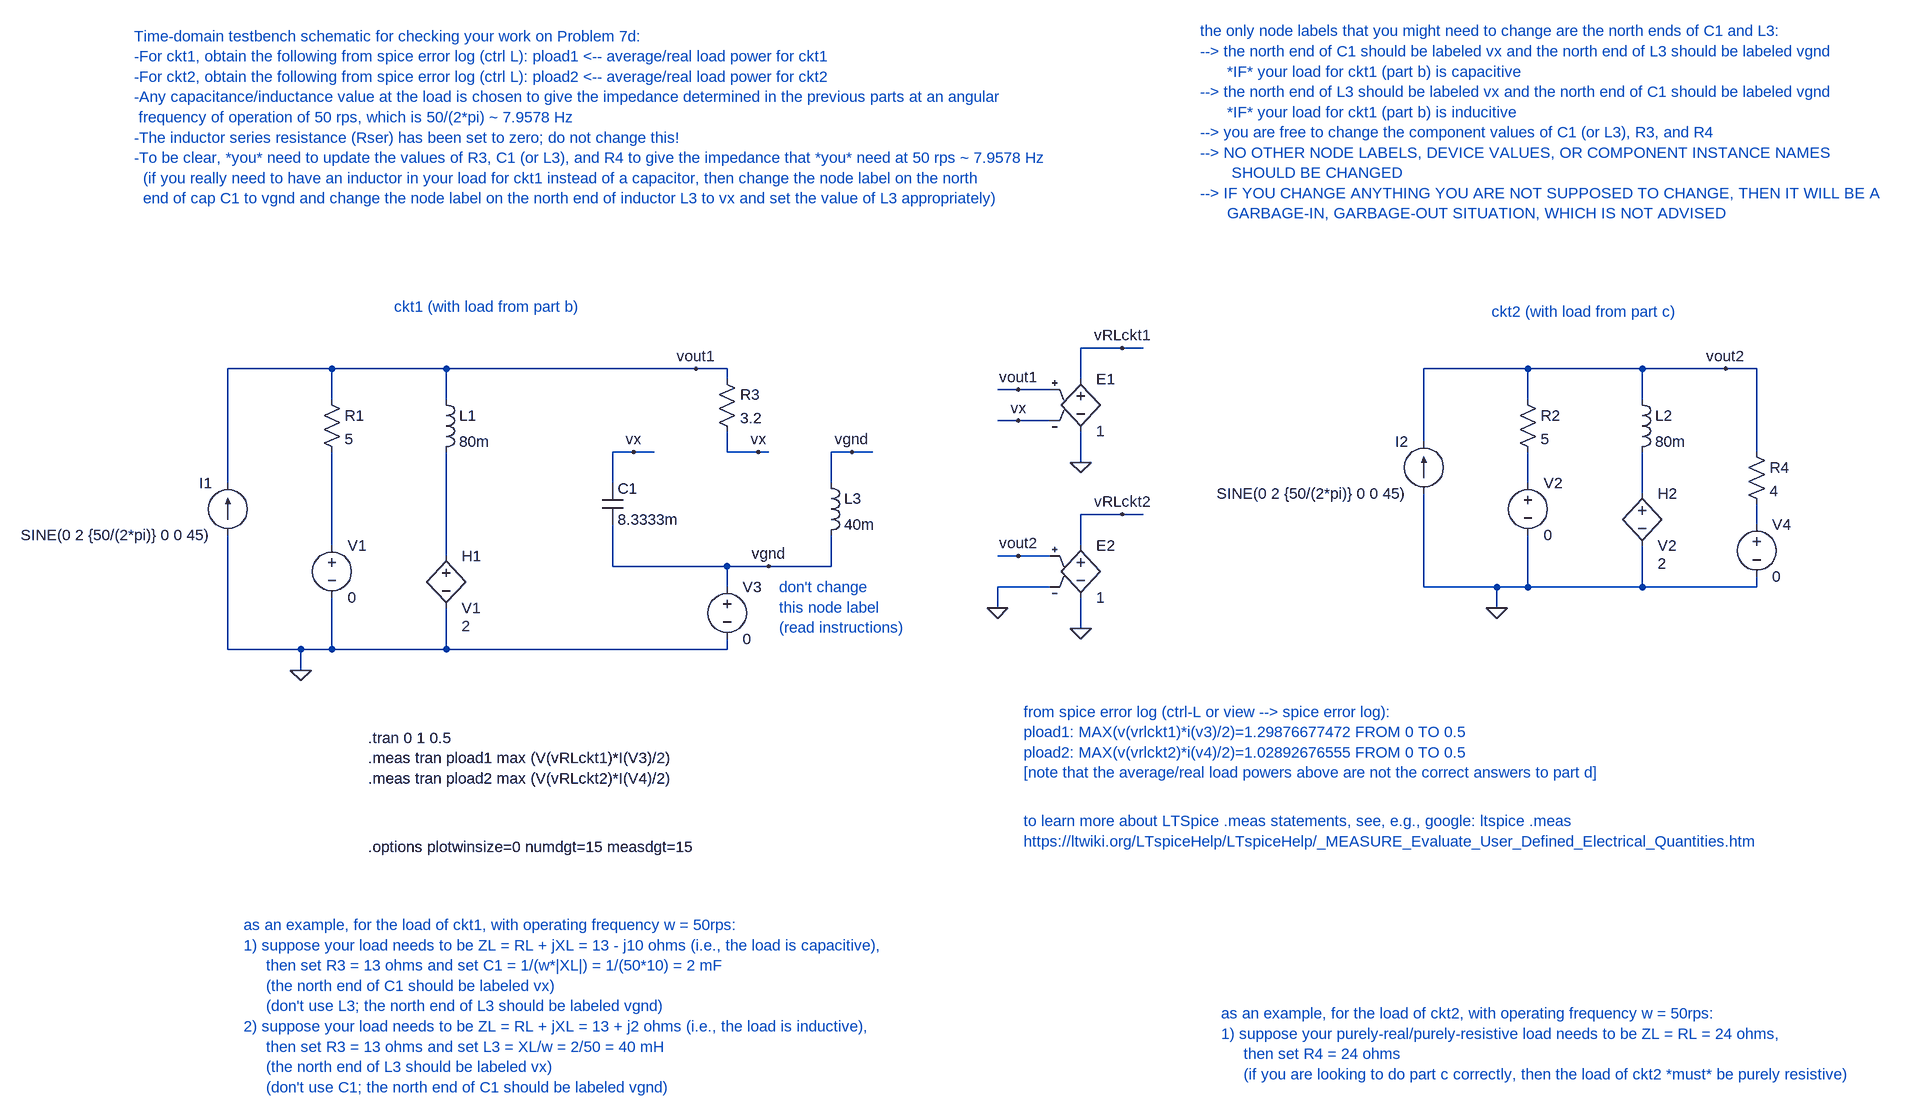
[diagram p0: schematic hw7_prob7d.asc]
hw7_prob7d.asc, the LTspice schematic file:
Version 4
SHEET 1 1480 1168
WIRE -16 -96 -80 -96
WIRE 16 -96 -16 -96
WIRE -1232 -64 -1392 -64
WIRE -1056 -64 -1232 -64
WIRE -672 -64 -1056 -64
WIRE -624 -64 -672 -64
WIRE 608 -64 448 -64
WIRE 784 -64 608 -64
WIRE 912 -64 784 -64
WIRE 960 -64 912 -64
WIRE -624 -48 -624 -64
WIRE -80 -48 -80 -96
WIRE -176 -32 -208 -32
WIRE -128 -32 -176 -32
WIRE -1232 -16 -1232 -64
WIRE -1056 -16 -1056 -64
WIRE 608 -16 608 -64
WIRE 784 -16 784 -64
WIRE -176 16 -208 16
WIRE -128 16 -176 16
WIRE 448 48 448 -64
WIRE -768 64 -800 64
WIRE -736 64 -768 64
WIRE -624 64 -624 32
WIRE -576 64 -624 64
WIRE -560 64 -576 64
WIRE -432 64 -464 64
WIRE -400 64 -432 64
WIRE 960 64 960 -64
WIRE -80 80 -80 32
WIRE -1392 112 -1392 -64
WIRE -800 112 -800 64
WIRE -464 112 -464 64
WIRE 608 112 608 64
WIRE 784 128 784 64
WIRE -16 160 -80 160
WIRE 16 160 -16 160
WIRE 960 176 960 144
WIRE -1232 208 -1232 64
WIRE -80 208 -80 160
WIRE -1056 224 -1056 64
WIRE -176 224 -208 224
WIRE -128 224 -176 224
WIRE -800 240 -800 176
WIRE -624 240 -800 240
WIRE -560 240 -624 240
WIRE -464 240 -464 192
WIRE -464 240 -560 240
WIRE -624 272 -624 240
WIRE -128 272 -208 272
WIRE 448 272 448 128
WIRE 560 272 448 272
WIRE 608 272 608 192
WIRE 608 272 560 272
WIRE 784 272 784 208
WIRE 784 272 608 272
WIRE 960 272 960 256
WIRE 960 272 784 272
WIRE -208 304 -208 272
WIRE 560 304 560 272
WIRE -80 336 -80 288
WIRE -1392 368 -1392 192
WIRE -1280 368 -1392 368
WIRE -1232 368 -1232 288
WIRE -1232 368 -1280 368
WIRE -1056 368 -1056 304
WIRE -1056 368 -1232 368
WIRE -624 368 -624 352
WIRE -624 368 -1056 368
WIRE -1280 400 -1280 368
FLAG -1280 400 0
FLAG -672 -64 vout1
FLAG 560 304 0
FLAG 912 -64 vout2
FLAG -80 80 0
FLAG -80 336 0
FLAG -16 -96 vRLckt1
FLAG -16 160 vRLckt2
FLAG -176 -32 vout1
FLAG -176 16 vx
FLAG -176 224 vout2
FLAG -208 304 0
FLAG -576 64 vx
FLAG -768 64 vx
FLAG -560 240 vgnd
FLAG -432 64 vgnd
SYMBOL res -1248 -32 R0
SYMATTR InstName R1
SYMATTR Value 5
SYMBOL ind -1072 -32 R0
SYMATTR InstName L1
SYMATTR Value 80m
SYMATTR SpiceLine Rser=0
SYMBOL current -1392 192 R180
WINDOW 0 24 80 Left 2
WINDOW 3 24 0 Left 2
WINDOW 123 24 52 Left 2
WINDOW 39 0 0 Left 0
SYMATTR InstName I1
SYMATTR Value SINE(0 2 {50/(2*pi)} 0 0 45)
SYMBOL h -1056 208 R0
WINDOW 123 24 124 Left 2
SYMATTR Value2 2
SYMATTR InstName H1
SYMATTR Value V1
SYMBOL voltage -1232 192 R0
WINDOW 123 0 0 Left 0
WINDOW 39 0 0 Left 0
SYMATTR InstName V1
SYMATTR Value 0
SYMBOL res -640 -64 R0
SYMATTR InstName R3
SYMATTR Value 3.2
SYMBOL voltage -624 256 R0
WINDOW 123 0 0 Left 0
WINDOW 39 0 0 Left 0
SYMATTR InstName V3
SYMATTR Value 0
SYMBOL res 592 -32 R0
SYMATTR InstName R2
SYMATTR Value 5
SYMBOL ind 768 -32 R0
SYMATTR InstName L2
SYMATTR Value 80m
SYMATTR SpiceLine Rser=0
SYMBOL current 448 128 R180
WINDOW 0 24 80 Left 2
WINDOW 3 24 0 Left 2
SYMATTR InstName I2
SYMATTR Value SINE(0 2 {50/(2*pi)} 0 0 45)
SYMBOL h 784 112 R0
WINDOW 123 24 124 Left 2
SYMATTR Value2 2
SYMATTR InstName H2
SYMATTR Value V2
SYMBOL voltage 608 96 R0
WINDOW 123 0 0 Left 0
WINDOW 39 0 0 Left 0
SYMATTR InstName V2
SYMATTR Value 0
SYMBOL res 944 48 R0
SYMATTR InstName R4
SYMATTR Value 4
SYMBOL voltage 960 160 R0
WINDOW 123 0 0 Left 0
WINDOW 39 0 0 Left 0
SYMATTR InstName V4
SYMATTR Value 0
SYMBOL cap -816 112 R0
SYMATTR InstName C1
SYMATTR Value 8.3333m
SYMBOL e -80 -64 R0
SYMATTR InstName E1
SYMATTR Value 1
SYMBOL e -80 192 R0
SYMATTR InstName E2
SYMATTR Value 1
SYMBOL ind -480 96 R0
SYMATTR InstName L3
SYMATTR Value 40m
SYMATTR SpiceLine Rser=0
TEXT -1176 504 Left 2 !.tran 0 1 0.5\n.meas tran pload1 max (V(vRLckt1)*I(V3)/2)\n.meas tran pload2 max (V(vRLckt2)*I(V4)/2)
TEXT -1536 -576 Left 2 ;Time-domain testbench schematic for checking your work on Problem 7d:\n-For ckt1, obtain the following from spice error log (ctrl L): pload1 <-- average/real load power for ckt1\n-For ckt2, obtain the following from spice error log (ctrl L): pload2 <-- average/real load power for ckt2\n-Any capacitance/inductance value at the load is chosen to give the impedance determined in the previous parts at an angular \n frequency of operation of 50 rps, which is 50/(2*pi) ~ 7.9578 Hz\n-The inductor series resistance (Rser) has been set to zero; do not change this!\n-To be clear, *you* need to update the values of R3, C1 (or L3), and R4 to give the impedance that *you* need at 50 rps ~ 7.9578 Hz\n  (if you really need to have an inductor in your load for ckt1 instead of a capacitor, then change the node label on the north \n  end of cap C1 to vgnd and change the node label on the north end of inductor L3 to vx and set the value of L3 appropriately)
TEXT -1136 -160 Left 2 ;ckt1 (with load from part b)
TEXT 552 -152 Left 2 ;ckt2 (with load from part c)
TEXT -168 632 Left 2 ;to learn more about LTSpice .meas statements, see, e.g., google: ltspice .meas\nhttps://ltwiki.org/LTspiceHelp/LTspiceHelp/_MEASURE_Evaluate_User_Defined_Electrical_Quantities.htm
TEXT -1176 672 Left 2 !.options plotwinsize=0 numdgt=15 measdgt=15
TEXT -168 464 Left 2 ;from spice error log (ctrl-L or view --> spice error log):\npload1: MAX(v(vrlckt1)*i(v3)/2)=1.29876677472 FROM 0 TO 0.5\npload2: MAX(v(vrlckt2)*i(v4)/2)=1.02892676555 FROM 0 TO 0.5\n[note that the average/real load powers above are not the correct answers to part d]
TEXT -1368 792 Left 2 ;as an example, for the load of ckt1, with operating frequency w = 50rps:\n1) suppose your load needs to be ZL = RL + jXL = 13 - j10 ohms (i.e., the load is capacitive), \n     then set R3 = 13 ohms and set C1 = 1/(w*|XL|) = 1/(50*10) = 2 mF\n     (the north end of C1 should be labeled vx)\n     (don't use L3; the north end of L3 should be labeled vgnd)\n2) suppose your load needs to be ZL = RL + jXL = 13 + j2 ohms (i.e., the load is inductive), \n     then set R3 = 13 ohms and set L3 = XL/w = 2/50 = 40 mH\n     (the north end of L3 should be labeled vx)\n     (don't use C1; the north end of C1 should be labeled vgnd)
TEXT 136 928 Left 2 ;as an example, for the load of ckt2, with operating frequency w = 50rps:\n1) suppose your purely-real/purely-resistive load needs to be ZL = RL = 24 ohms, \n     then set R4 = 24 ohms\n     (if you are looking to do part c correctly, then the load of ckt2 *must* be purely resistive)
TEXT -544 272 Left 2 ;don't change\nthis node label\n(read instructions)
TEXT 104 -584 Left 2 ;the only node labels that you might need to change are the north ends of C1 and L3:\n--> the north end of C1 should be labeled vx and the north end of L3 should be labeled vgnd\n      *IF* your load for ckt1 (part b) is capacitive\n--> the north end of L3 should be labeled vx and the north end of C1 should be labeled vgnd\n      *IF* your load for ckt1 (part b) is inducitive\n--> you are free to change the component values of C1 (or L3), R3, and R4\n--> NO OTHER NODE LABELS, DEVICE VALUES, OR COMPONENT INSTANCE NAMES\n       SHOULD BE CHANGED\n--> IF YOU CHANGE ANYTHING YOU ARE NOT SUPPOSED TO CHANGE, THEN IT WILL BE A \n      GARBAGE-IN, GARBAGE-OUT SITUATION, WHICH IS NOT ADVISED

The netlist it stands for:
* hw7_prob7d.asc
R1 vout1 N004 5
L1 vout1 N005 80m Rser=0
I1 0 vout1 SINE(0 2 {50/(2*pi)} 0 0 45)
H1 N005 0 V1 2
V1 N004 0 0
R3 vout1 vx 3.2
V3 vgnd 0 0
R2 vout2 N001 5
L2 vout2 N002 80m Rser=0
I2 0 vout2 SINE(0 2 {50/(2*pi)} 0 0 45)
H2 N002 0 V2 2
V2 N001 0 0
R4 vout2 N003 4
V4 N003 0 0
C1 vx vgnd 8.3333m
E1 vRLckt1 0 vout1 vx 1
E2 vRLckt2 0 vout2 0 1
L3 vgnd vgnd 40m Rser=0
.tran 0 1 0.5
.meas tran pload1 max (V(vRLckt1)*I(V3)/2)
.meas tran pload2 max (V(vRLckt2)*I(V4)/2)
* Time-domain testbench schematic for checking your work on Problem 7d:
* -For ckt1, obtain the following from spice error log (ctrl L): pload1 <-- average/real load power for ckt1
* -For ckt2, obtain the following from spice error log (ctrl L): pload2 <-- average/real load power for ckt2
* -Any capacitance/inductance value at the load is chosen to give the impedance determined in the previous parts at an angular
*  frequency of operation of 50 rps, which is 50/(2*pi) ~ 7.9578 Hz
* -The inductor series resistance (Rser) has been set to zero; do not change this!
* -To be clear, *you* need to update the values of R3, C1 (or L3), and R4 to give the impedance that *you* need at 50 rps ~ 7.9578 Hz
*   (if you really need to have an inductor in your load for ckt1 instead of a capacitor, then change the node label on the north
*   end of cap C1 to vgnd and change the node label on the north end of inductor L3 to vx and set the value of L3 appropriately)
* ckt1 (with load from part b)
* ckt2 (with load from part c)
* to learn more about LTSpice .meas statements, see, e.g., google: ltspice .meas
* https://ltwiki.org/LTspiceHelp/LTspiceHelp/_MEASURE_Evaluate_User_Defined_Electrical_Quantities.htm
.options plotwinsize=0 numdgt=15 measdgt=15
* from spice error log (ctrl-L or view --> spice error log):
* pload1: MAX(v(vrlckt1)*i(v3)/2)=1.29876677472 FROM 0 TO 0.5
* pload2: MAX(v(vrlckt2)*i(v4)/2)=1.02892676555 FROM 0 TO 0.5
* [note that the average/real load powers above are not the correct answers to part d]
* as an example, for the load of ckt1, with operating frequency w = 50rps:
* 1) suppose your load needs to be ZL = RL + jXL = 13 - j10 ohms (i.e., the load is capacitive),
*      then set R3 = 13 ohms and set C1 = 1/(w*|XL|) = 1/(50*10) = 2 mF
*      (the north end of C1 should be labeled vx)
*      (don't use L3; the north end of L3 should be labeled vgnd)
* 2) suppose your load needs to be ZL = RL + jXL = 13 + j2 ohms (i.e., the load is inductive),
*      then set R3 = 13 ohms and set L3 = XL/w = 2/50 = 40 mH
*      (the north end of L3 should be labeled vx)
*      (don't use C1; the north end of C1 should be labeled vgnd)
* as an example, for the load of ckt2, with operating frequency w = 50rps:
* 1) suppose your purely-real/purely-resistive load needs to be ZL = RL = 24 ohms,
*      then set R4 = 24 ohms
*      (if you are looking to do part c correctly, then the load of ckt2 *must* be purely resistive)
* don't change
* this node label
* (read instructions)
* the only node labels that you might need to change are the north ends of C1 and L3:
* --> the north end of C1 should be labeled vx and the north end of L3 should be labeled vgnd
*       *IF* your load for ckt1 (part b) is capacitive
* --> the north end of L3 should be labeled vx and the north end of C1 should be labeled vgnd
*       *IF* your load for ckt1 (part b) is inducitive
* --> you are free to change the component values of C1 (or L3), R3, and R4
* --> NO OTHER NODE LABELS, DEVICE VALUES, OR COMPONENT INSTANCE NAMES
*        SHOULD BE CHANGED
* --> IF YOU CHANGE ANYTHING YOU ARE NOT SUPPOSED TO CHANGE, THEN IT WILL BE A
*       GARBAGE-IN, GARBAGE-OUT SITUATION, WHICH IS NOT ADVISED
.backanno
.end

* Results of the author's LTspice run, read from the files saved beside the schematic
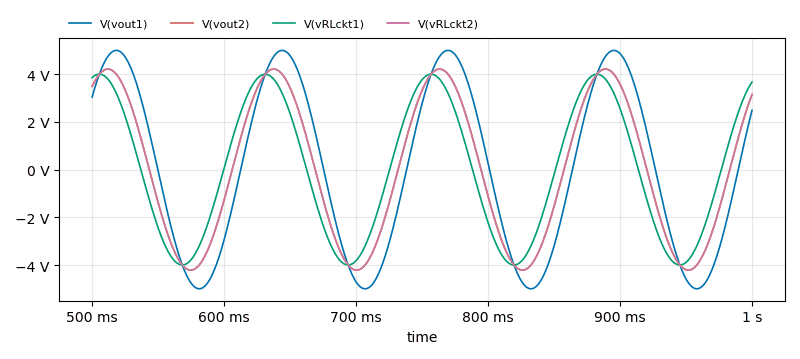
[diagram p1: Transient Analysis of hw7_prob7d.asc, plotted from the saved traces]
* Transient Analysis, 1 run:
*   V(vout1): min -4.997 V, max 4.998 V, average -14.33 mV, rms 3.537 V, last 2.484 V
*   V(vout2): min -4.214 V, max 4.214 V, average -17.72 mV, rms 2.978 V, last 3.144 V
*   V(vRLckt1): min -3.998 V, max 4 V, average -19.89 mV, rms 2.821 V, last 3.672 V
*   V(vRLckt2): min -4.214 V, max 4.214 V, average -17.72 mV, rms 2.978 V, last 3.144 V
* From the log:
*   pload1: MAX(v(vrlckt1)*i(v3)/2)=2.50026047011 FROM 0 TO 0.5
*   pload2: MAX(v(vrlckt2)*i(v4)/2)=2.21992772377 FROM 0 TO 0.5